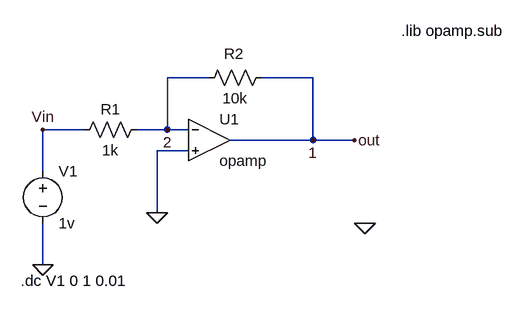
[diagram p0: schematic opamp.asc]
opamp.asc, the LTspice schematic file:
Version 4
SHEET 1 880 680
WIRE 224 -80 160 -80
WIRE 384 -80 304 -80
WIRE 32 0 -32 0
WIRE 160 0 160 -80
WIRE 160 0 112 0
WIRE 192 0 160 0
WIRE 384 16 384 -80
WIRE 384 16 256 16
WIRE 448 16 384 16
WIRE 192 32 144 32
WIRE -32 64 -32 0
WIRE 144 128 144 32
WIRE -32 208 -32 144
FLAG -32 208 0
FLAG 144 128 0
FLAG 464 144 0
FLAG 160 0 2
FLAG -32 0 Vin
FLAG 384 16 1
FLAG 448 16 out
SYMBOL res 320 -96 R90
WINDOW 0 -5 58 VBottom 2
WINDOW 3 32 56 VTop 2
SYMATTR InstName R2
SYMATTR Value 10k
SYMBOL res 128 -16 R90
WINDOW 0 0 56 VBottom 2
WINDOW 3 32 56 VTop 2
SYMATTR InstName R1
SYMATTR Value 1k
SYMBOL voltage -32 48 R0
WINDOW 123 0 0 Left 2
WINDOW 39 0 0 Left 2
SYMATTR InstName V1
SYMATTR Value 1v
SYMBOL Opamps\\opamp 224 -48 R0
SYMATTR InstName U1
TEXT 520 -152 Left 2 !.lib opamp.sub
TEXT -66 232 Left 2 !.dc V1 0 1 0.01

The netlist it stands for:
* opamp.asc
R2 out 2 10k
R1 2 Vin 1k
V1 Vin 0 1v
XU1 2 0 out opamp Aol=100K GBW=10Meg  ; pins invin noninvin out
.lib opamp.sub
.dc V1 0 1 0.01
.backanno
.end